# Altium schematic sheet sb-sonata-lcd.SchDoc: LCD
size Letter; Organization: NewAE Technology Inc.; Address1: 1083 Queen St., Suite 196; Address2: Halifax; Address3: NS; Address4: Canada B3H 0B2; SheetNumber: 20; SheetTotal: 20; SheetApproved: YES
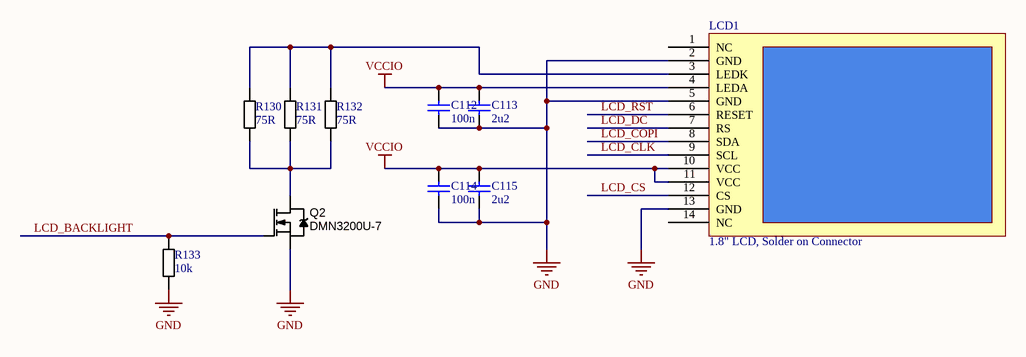
[diagram p0: sb-sonata-lcd.SchDoc]

## Parts
C112  100n  [CAPC0402_M]
C113  2u2  [CAPC0603_M]
C114  100n  [CAPC0402_M]
C115  2u2  [CAPC0603_M]
LCD1  1.8" LCD, Solder on Connector  [ADAFRUIT618]
Q2  DMN3200U-7  [SOT95P245X110-3M]
R130  75R  [RESC2012X70N]
R131  75R  [RESC2012X70N]
R132  75R  [RESC2012X70N]
R133  10k  [RESC1005X40N]

## Nets
GND: C112.2 C113.2 C114.2 C115.2 LCD1.2(GND) LCD1.5(GND) LCD1.13(GND) Q2.2(S) R133.2
VCCIO: C112.1 C113.1 C114.1 C115.1 LCD1.4(LEDA) LCD1.10(VCC) LCD1.11(VCC)
LCD_BACKLIGHT: Q2.1(G) R133.1
LCD_CLK: LCD1.9(SCL)
LCD_COPI: LCD1.8(SDA)
LCD_CS: LCD1.12(CS)
LCD_DC: LCD1.7(RS)
LCD_RST: LCD1.6(RESET)
NetLCD1_3: LCD1.3(LEDK) R130.1 R131.1 R132.1
NetQ2_3: Q2.3(D) R130.2 R131.2 R132.2

Not connected (* = marked no-connect by the designer): LCD1 1(NC) 14(NC)

## Notes on the sheet
- Title:
- Date:
- Rev:
- Time:
- Project:
- Sheet
- of
- License:
- Copyright © NewAE Technology Inc.
- Approved:
- NewAE.com
- File:

## Library data of the parts
C112 C114 = CCHIP-100n-0402: 100n, 0402; Manufacture Part Number 1: CGA2B3X7R1V104K050BB; Component Group: Capacitor; Case-EIA: 0402; Part Number: CCHIP-100n-0402; Footprint: 0402; Pin Count: 2; Supplier 1: Digi-Key; Supplier Part Number 1: 445-6901-1-ND; Value: 100n; Mounting Technology: SMT; Component Kind: Standard; Component Type: Standard
C113 C115 = CCHIP-2u2-0603-16V: 2u2, 0603; Manufacture 1: Taiyo Yuden; Manufacture Part Number 1: EMK107BJ225KA-T; Component Group: Capacitor; Case-EIA: 0603; Case-Metric: 1608; Rated Voltage: 16VDC; Part Number: CCHIP-2u2-0603-16V; Footprint: 0603; Pin Count: 2; Supplier 1: Digi-Key; Supplier Part Number 1: 587-1430-1-ND; Value: 2u2; Mounting Technology: SMT; Component Kind: Standard; Component Type: Standard
LCD1 = LCD1.8INCH_ADAFRUIT618: Component Group: Optical; PP Material Stack: 0; Part Number: LCD1.8INCH_ADAFRUIT618; Pin Count: 14; Component Kind: Standard; Component Type: Standard; PP Rotation: 0; PP Rotation1: 0
Q2 = DMN3200U-7: MOSFET N-CH 30V 2.2A SOT23-3; Manufacture 1: Diodes Inc.; Rated Power: 3A; PP Material Stack: 0; Part Number: DMN3200U-7; Component Group: MOSFET; Footprint: SOT23; Manufacture Part Number 1: DMN3200U-7; Pin Count: 3; Supplier 1: Digi-Key; Supplier Part Number 1: DMN3200U-7DICT-ND; Rated Voltage: 30V; Mounting Technology: SMT; RoHS: Yes; Component Kind: Standard; Component Type: Standard; PP Rotation: 0
R130-R132 = RCHIP-75R-0805: 75R res, 0805, 1%, 1/8W; Manufacture 1: Yageo; Manufacture Part Number 1: RC0805FR-0775RL; Component Group: Resistor; Case-EIA: 0805; Rated Power: 0.125W; Rated Voltage: 75VDC; Part Number: RCHIP-75R-0805; Footprint: 0805; Pin Count: 2; Supplier 1: Digi-Key; Supplier Part Number 1: 311-75.0CRCT-ND; Value: 75R; Tolerance: 1%; Mounting Technology: SMT; Temperature Range: -55C to 155C; Component Kind: Standard; Component Type: Standard
R133 = RCHIP-10K-0402: 10k res, 0402, 1%, 1/16W; Manufacture 1: Yageo; Manufacture Part Number 1: RC0402FR-0710KL; Component Group: Resistor; Case-EIA: 0402; Case-Metric: 1005; Rated Power: 0.063W; Rated Voltage: 75VDC; Part Number: RCHIP-10K-0402; Footprint: 0402; Pin Count: 2; Supplier 1: Digi-Key; Supplier Part Number 1: 311-10.0KLRCT-ND; Value: 10k; Tolerance: 1%; Mounting Technology: SMT; Temperature Range: -55C to 155C; Component Kind: Standard; Component Type: Standard